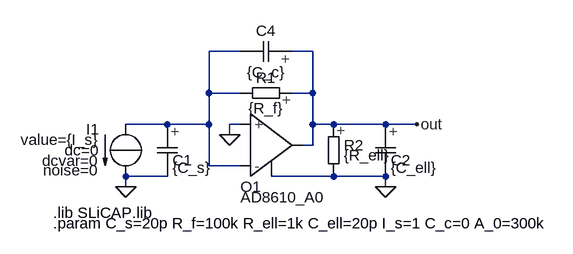
[diagram p0: schematic transimpedance.asc]
transimpedance.asc, the LTspice schematic file:
Version 4
SHEET 1 880 680
WIRE 112 0 64 0
WIRE 224 0 192 0
WIRE 64 64 64 0
WIRE 112 64 64 64
WIRE 224 64 224 0
WIRE 224 64 192 64
WIRE 0 112 -64 112
WIRE 64 112 64 64
WIRE 64 112 0 112
WIRE 112 112 96 112
WIRE 224 112 224 64
WIRE 256 112 224 112
WIRE 336 112 256 112
WIRE 384 112 336 112
WIRE 96 128 96 112
WIRE 224 144 224 112
WIRE 224 144 208 144
WIRE 64 176 64 112
WIRE 112 176 64 176
WIRE 0 192 -64 192
WIRE 256 192 160 192
WIRE 336 192 256 192
WIRE -64 208 -64 192
WIRE 336 208 336 192
FLAG -64 208 0
FLAG 384 112 out
FLAG 336 208 0
FLAG 96 128 0
SYMBOL SLC 0 112 R0
SYMATTR InstName C1
SYMATTR Value {C_s}
SYMBOL SLI -64 112 M0
SYMATTR InstName I1
SYMATTR Value value={I_s}
SYMBOL SLR 256 112 R0
SYMATTR InstName R2
SYMATTR Value {R_ell}
SYMBOL SLC 336 112 R0
SYMATTR InstName C2
SYMATTR Value {C_ell}
SYMBOL SLR 192 64 R90
WINDOW 0 -8 40 VBottom 2
WINDOW 3 8 40 VTop 2
SYMATTR InstName R1
SYMATTR Value {R_f}
SYMBOL SLO 128 144 R0
WINDOW 0 -15 64 Left 2
WINDOW 3 -15 80 Left 2
SYMATTR InstName O1
SYMATTR Value AD8610_A0
SYMBOL SLC 192 0 R90
WINDOW 0 -16 40 VBottom 2
WINDOW 3 16 40 VTop 2
SYMATTR InstName C4
SYMATTR Value {C_c}
TEXT -176 264 Left 2 !.param C_s=20p R_f=100k R_ell=1k C_ell=20p I_s=1 C_c=0 A_0=300k
TEXT -176 248 Left 2 !.lib SLiCAP.lib

The netlist it stands for:
* transimpedance.asc
C1 N001 0 {C_s}
I1 N001 0 I value={I_s} dc=0 dcvar=0 noise=0
R2 out 0 {R_ell}
C2 out 0 {C_ell}
R1 out N001 {R_f}
O1 0 N001 out 0 AD8610_A0
C4 out N001 {C_c}
.param C_s=20p R_f=100k R_ell=1k C_ell=20p I_s=1 C_c=0 A_0=300k
.lib SLiCAP.lib
.backanno
.end